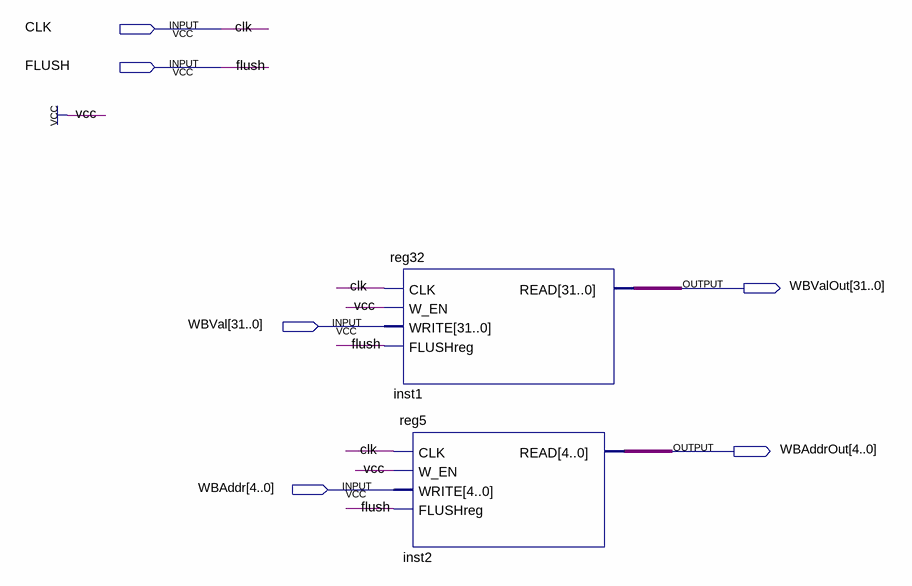
[diagram p0: schematic sheet]
// Quartus schematic MW-WB_barrier.bdf as structural Verilog: 2 symbols, 6 pins
module \MW-WB_barrier  (
  input  CLK,
  input  FLUSH,
  input  [31:0] WBVal,
  input  [4:0] WBAddr,
  output [31:0] WBValOut,
  output [4:0] WBAddrOut
);

  reg32 inst1 (.CLK(CLK), .W_EN(1'b1), .WRITE(WBVal), .FLUSHreg(FLUSH), .READ(WBValOut));
  reg5 inst2 (.CLK(CLK), .W_EN(1'b1), .WRITE(WBAddr), .FLUSHreg(FLUSH), .READ(WBAddrOut));
endmodule
